# EAGLE design LNC (EAGLE 7.7.0)
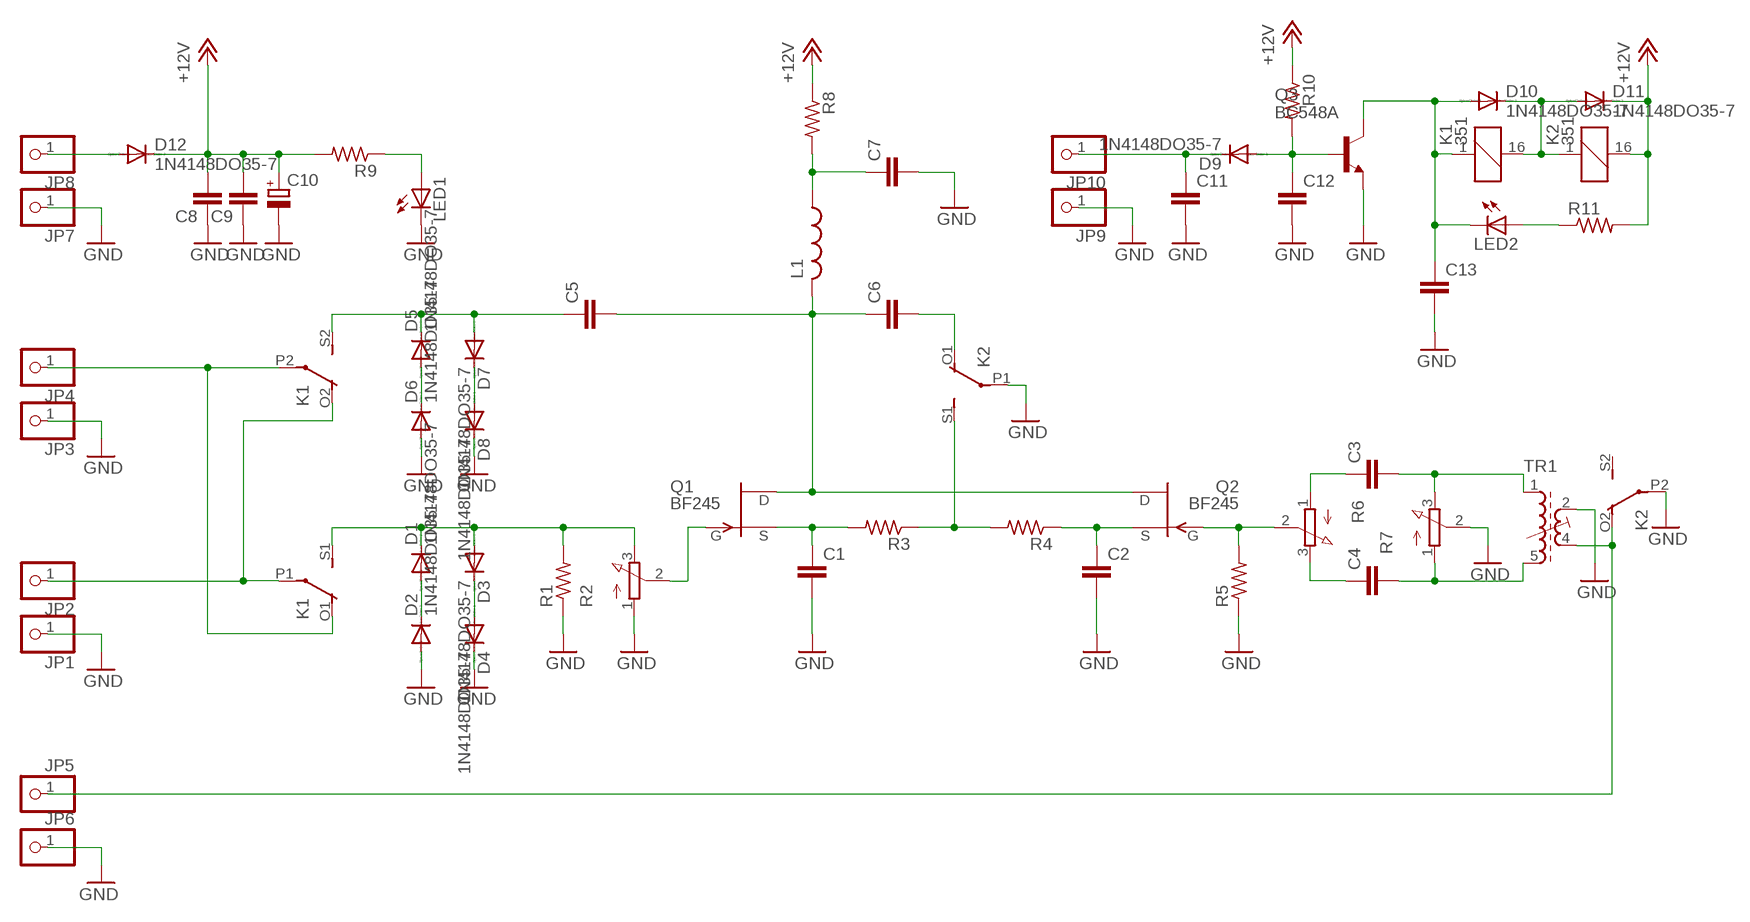
[diagram p0: schematic, sheet 1]

## Parts
C1  C-EU050-030X075  [C050-030X075]
C2  C-EU050-030X075  [C050-030X075]
C3  C-EU050-030X075  [C050-030X075]
C4  C-EU050-030X075  [C050-030X075]
C5  C-EU050-030X075  [C050-030X075]
C6  C-EU050-030X075  [C050-030X075]
C7  C-EU050-030X075  [C050-030X075]
C8  C-EU050-030X075  [C050-030X075]
C9  C-EU050-030X075  [C050-030X075]
C10  CPOL-EUE2.5-7  [E2,5-7]
C11  C-EU050-030X075  [C050-030X075]
C12  C-EU050-030X075  [C050-030X075]
C13  C-EU050-030X075  [C050-030X075]
D1  1N4148DO35-7  [DO35-7]
D2  1N4148DO35-7  [DO35-7]
D3  1N4148DO35-7  [DO35-7]
D4  1N4148DO35-7  [DO35-7]
D5  1N4148DO35-7  [DO35-7]
D6  1N4148DO35-7  [DO35-7]
D7  1N4148DO35-7  [DO35-7]
D8  1N4148DO35-7  [DO35-7]
D9  1N4148DO35-7  [DO35-7]
D10  1N4148DO35-7  [DO35-7]
D11  1N4148DO35-7  [DO35-7]
D12  1N4148DO35-7  [DO35-7]
JP1  PINHD-1X1  [1X01]
JP2  PINHD-1X1  [1X01]
JP3  PINHD-1X1  [1X01]
JP4  PINHD-1X1  [1X01]
JP5  PINHD-1X1  [1X01]
JP6  PINHD-1X1  [1X01]
JP7  PINHD-1X1  [1X01]
JP8  PINHD-1X1  [1X01]
JP9  PINHD-1X1  [1X01]
JP10  PINHD-1X1  [1X01]
K1  351  [351]
K2  351  [351]
L1  L-US0207/10  [0207/10]
LED1  LED3MM  [LED3MM]
LED2  LED3MM  [LED3MM]
Q1  BF245  [TO92]
Q2  BF245  [TO92]
Q3  BC548A  [TO92-EBC]
R1  R-US_0204/7  [0204/7]
R2  3RP/1610N  [3RP/1610N]
R3  R-US_0204/7  [0204/7]
R4  R-US_0204/7  [0204/7]
R5  R-US_0204/7  [0204/7]
R6  3RP/1610N  [3RP/1610N]
R7  3RP/1610N  [3RP/1610N]
R8  R-US_0204/7  [0204/7]
R9  R-US_0204/7  [0204/7]
R10  R-US_0204/7  [0204/7]
R11  R-US_0204/7  [0204/7]
TR1  71-4-1542  [71-5]

## Nets
+12V: C8.2 C9.2 C10.+ D11.C D12.C K2.16 R8.1 R9.2 R10.1 R11.2
GND: C1.2 C2.2 C7.2 C8.1 C9.1 C10.- C11.2 C12.2 C13.2 D2.A D4.C D6.A D8.C JP1.1 JP3.1 JP6.1 JP7.1 JP9.1 K2.P1(2:P) K2.P2(3:P) LED1.K(C) Q3.E R1.1 R2.1(A) R5.1 R7.2(S) TR1.2(A2)
N$1: JP4.1 K1.O1(2:O) K1.P2(3:P)
N$2: JP2.1 K1.O2(3:O) K1.P1(2:P)
N$3: Q1.3(G) R2.2(S)
N$4: C2.1 Q2.2(S) R4.1
N$5: C5.1 D5.C D7.A K1.S2(3:S)
N$6: D1.C D3.A K1.S1(2:S) R1.2 R2.3(E)
N$7: K2.S1(2:S) R3.1 R4.2
N$8: D1.A D2.C
N$9: D3.C D4.A
N$10: C1.1 Q1.2(S) R3.2
N$11: Q2.3(G) R5.2 R6.2(S)
N$12: C3.1 R6.1(A)
N$13: D5.A D6.C
N$14: D7.C D8.A
N$15: C3.2 R7.3(E) TR1.1(A1)
N$16: C4.2 R7.1(A) TR1.5(E1)
N$17: C4.1 R6.3(E)
N$18: C5.2 C6.1 L1.2 Q1.1(D) Q2.1(D)
N$19: C6.2 K2.O1(2:O)
N$20: JP5.1 K2.O2(3:O) TR1.4(E2)
N$21: D10.C D11.A K1.16 K2.1
N$22: C7.1 L1.1 R8.2
N$23: LED1.A R9.1
N$24: C12.1 D9.A Q3.B R10.2
N$25: C13.1 D10.A K1.1 LED2.K(C) Q3.C
N$26: LED2.A R11.1
N$27: C11.1 D9.C JP10.1
N$28: D12.A JP8.1
Unconnected: K2.S2(3:S) TR1.S1 TR1.S2

## Library data of the parts
C1-C9 C11-C13 = rcl:C-EU: CAPACITOR, European symbol
C10 = rcl:CPOL-EU: POLARIZED CAPACITOR, European symbol
D1-D12 = diode:1N4148: DIODE high speed (Philips)
JP1-JP10 = pinhead:PINHD-1X1: PIN HEADER
K1 K2 = relay:351: RELAY 2 x switch, Omron; OC_FARNELL: unknown; OC_NEWARK: unknown
L1 = rcl:L-US: INDUCTOR, American symbol
LED1 LED2 = led:LED: LED OSRAM: - CHIPLED LG R971, LG N971, LY N971, LG Q971, LY Q971, LO R971, LY R971 LH N974, LH R974 LS Q976, LO Q976, LY Q976 LO Q996 - Hyper CHIPLED LW Q18S LB Q993, LB Q99A, LB R99A - SideLED LS A670, LO A670, LY A670, LG A670, LP A670 LB A673, LV A673, LT A673, LW A673 LH A674 LY A675 LS A676, LA A676, LO A676, LY A676, LW A676 LS A679, LY A679, LG A679 - Hyper Micro SIDELED® LS Y876, LA Y876, LO Y876, LY Y876 LT Y87S - SmartLED LW L88C, LW L88S LB L89C, LB L89S, LG L890 LS L89K, LO L89K, LY L89K LS L896, LA L896, LO L896, LY L896 - TOPLED LS T670, LO T670, LY T670, LG T670, LP T670 LSG T670, LSP T670, LSY T670, LOP T670, LYG T670 LG T671, LOG T671, LSG T671 LB T673, LV T673, LT T673, LW T673 LH T674 LS T676, LA T676, LO T676, LY T676, LB T676, LH T676, LSB T676, LW T676 LB T67C, LV T67C, LT T67C, LS T67K, LO T67K, LY T67K, LW E67C LS E67B, LA E67B, LO E67B, LY E67B, LB E67C, LV E67C, LT E67C LW T67C LS T679, LY T679, LG T679 LS T770, LO T770, LY T770, LG T770, LP T770 LB T773, LV T773, LT T773, LW T773 LH T774 LS E675, LA E675, LY E675, LS T675 LS T776, LA T776, LO T776, LY T776, LB T776 LHGB T686 LT T68C, LB T68C - Hyper Mini TOPLED® LB M676 - Mini TOPLED Santana® LG M470 LS M47K, LO M47K, LY M47K Source: http://www.osram.convergy.de LUXEON: - LUMILED® LXK2-PW12-R00, LXK2-PW12-S00, LXK2-PW14-U00, LXK2-PW14-V00 LXK2-PM12-R00, LXK2-PM12-S00, LXK2-PM14-U00 LXK2-PE12-Q00, LXK2-PE12-R00, LXK2-PE12-S00, LXK2-PE14-T00, LXK2-PE14-U00 LXK2-PB12-K00, LXK2-PB12-L00, LXK2-PB12-M00, LXK2-PB14-N00, LXK2-PB14-P00, LXK2-PB14-Q00 LXK2-PR12-L00, LXK2-PR12-M00, LXK2-PR14-Q00, LXK2-PR14-R00 LXK2-PD12-Q00, LXK2-PD12-R00, LXK2-PD12-S00 LXK2-PH12-R00, LXK2-PH12-S00 LXK2-PL12-P00, LXK2-PL12-Q00, LXK2-PL12-R00 Source: www.luxeon.com KINGBRIGHT: KA-3528ASYC Source: www.kingbright.com
Q1 Q2 = transistor-fet:BF245: N-Channel Junction FET http://www.onsemi.com/pub/Collateral/BF245A-D.PDF
Q3 = transistor-npn:BC548*: NPN Transistor
R1 R3-R5 R8-R11 = rcl:R-US_: RESISTOR, American symbol
R2 R6 R7 = pot:3RP/1610N: 16mm Potentiometer one level Source: http://www.alphapotentiometers.net/html/16mm_pot_2.html
TR1 = inductor-neosid:71-4-: TRANSFORMER adjustable filter transformer; OC_FARNELL: unknown; OC_NEWARK: unknown

## Board
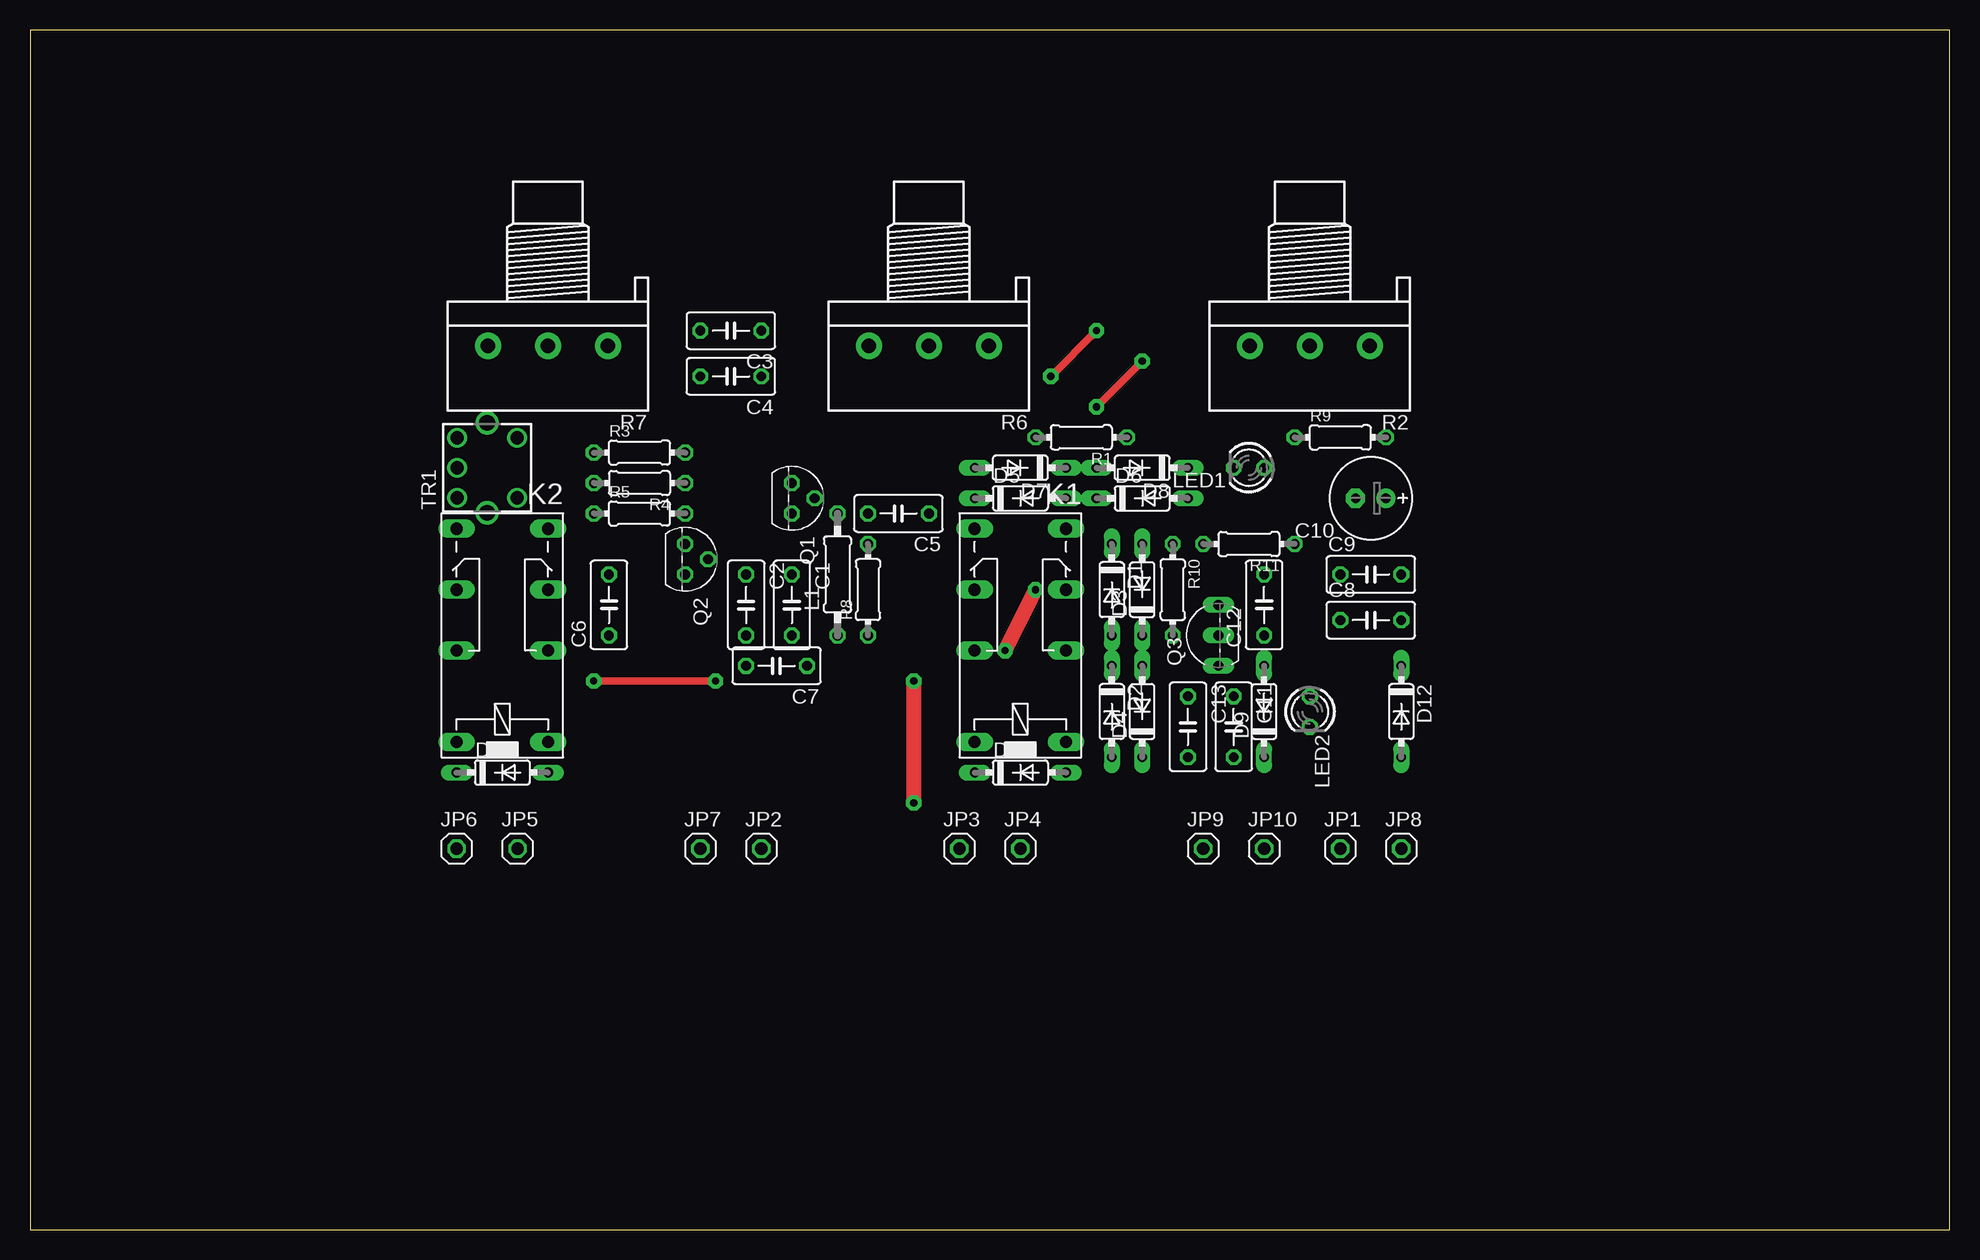
[diagram p1: board, top side]
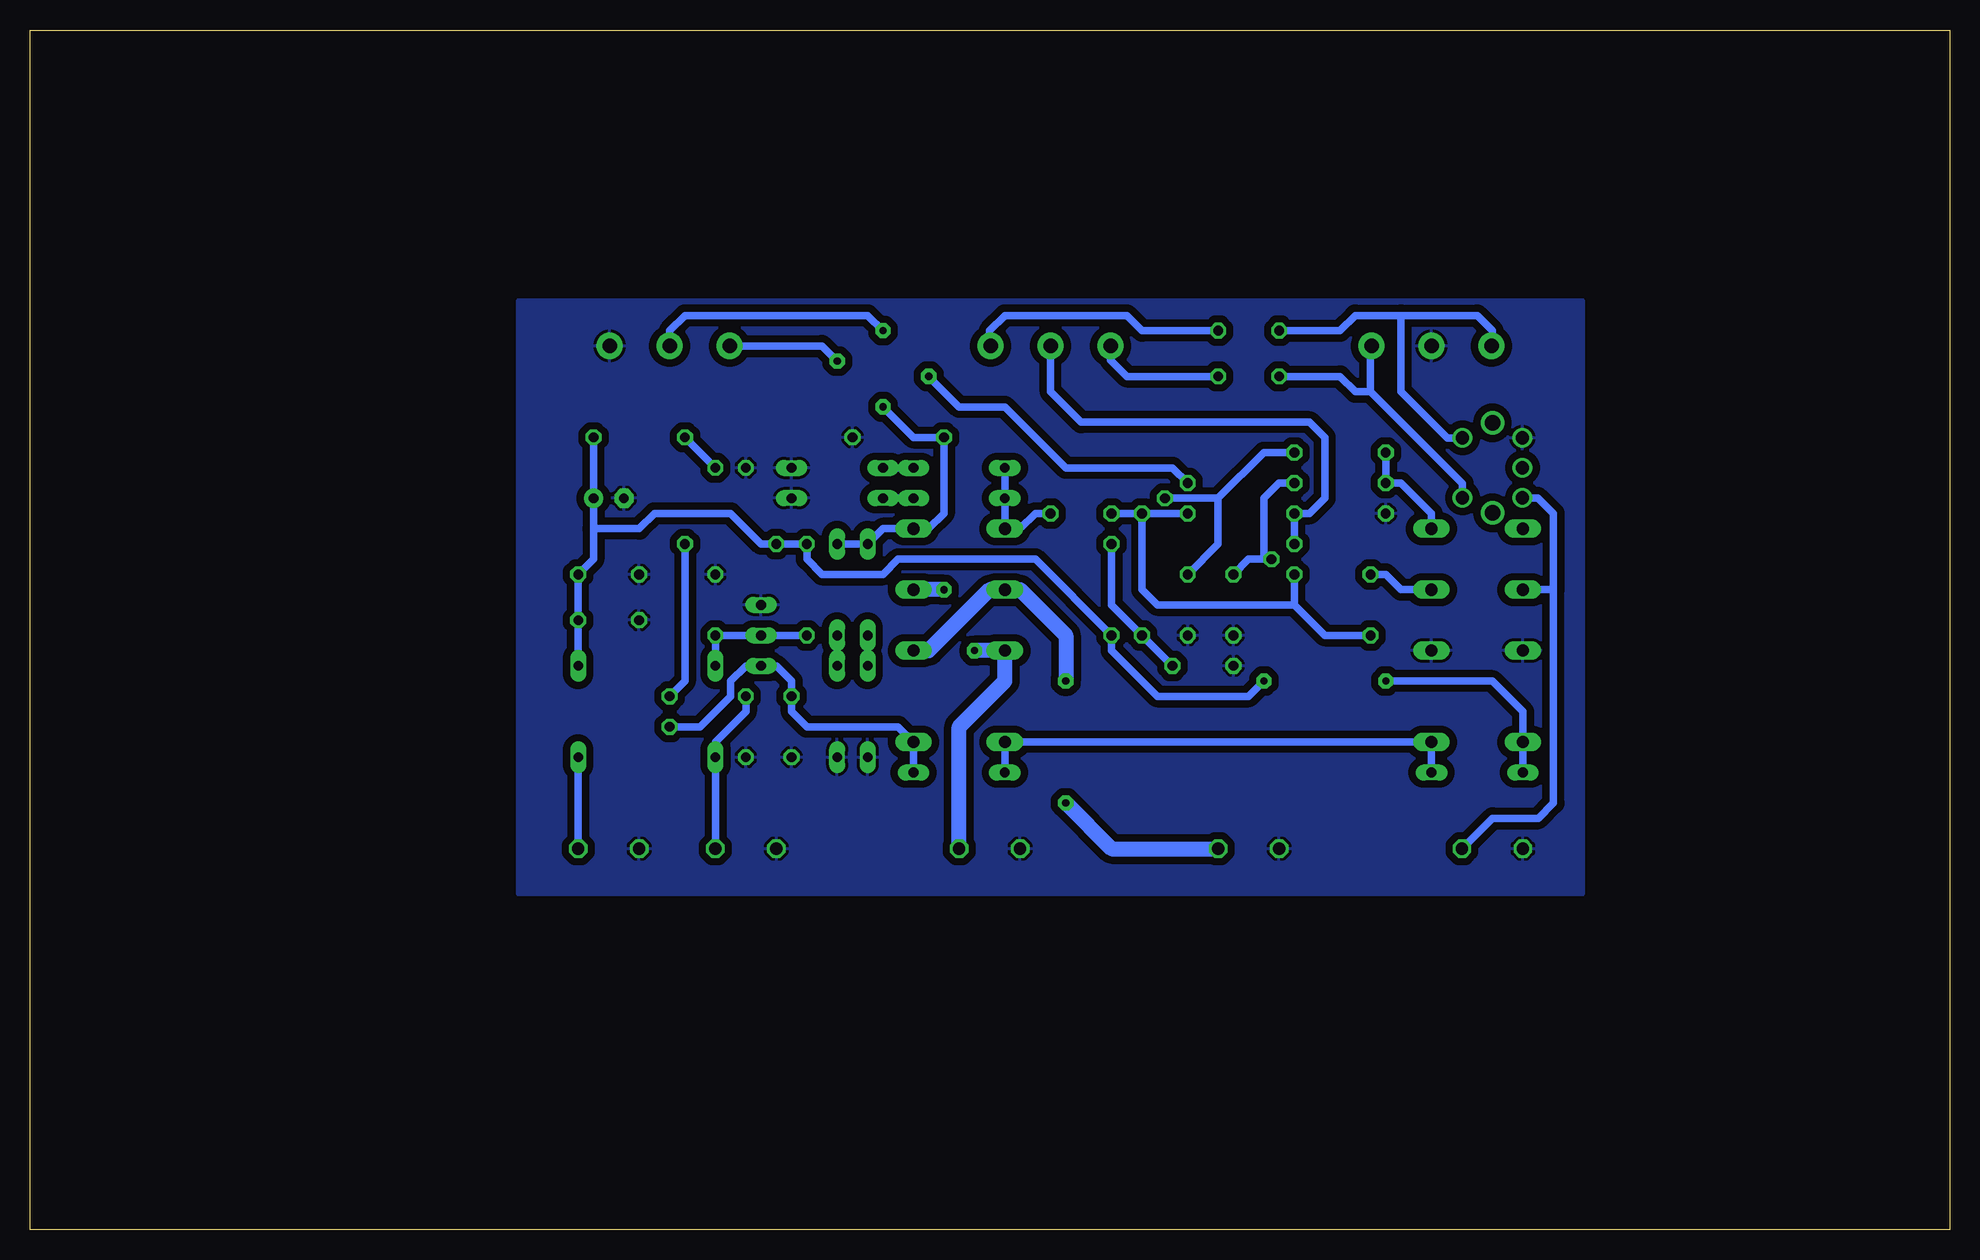
[diagram p2: board, bottom side, seen from below]

Size 160 x 100 mm. Coordinates in mm from the lower left corner, seen from the top.
Outline: 0,0 160,0 160,100 0,100 0,0
Copper layers (1*16): Top 0.035mm / dielectric 1.5mm / Bottom 0.035mm
Design rules "default": minimum track width 10mil, minimum drill 24mil, track to track 8mil, track to pad 8mil, pad to pad 8mil, via to via 8mil, smd to smd 8mil, copper to edge 40mil, drill to drill 8mil, minimum pad ring 10mil, minimum via ring 8mil, stop-mask expansion 4mil, vias tented up to drill 0mil, thermal gap 10mil

### Footprints (pad centres in the part's own frame; a part is rotated, then mirrored left to right if it is on the bottom)
C050-030X075 = drill 0.813 octagon: 1 -2.54,0; 2 2.54,0
E2,5-7 = drill 0.813 pad 1.6: + -1.27,0 | drill 0.813 pad 1.6 octagon: - 1.27,0
DO35-7 = drill 0.813 long: A 3.81,0; C -3.81,0
1X01 = drill 1.016 octagon: 1 0,0
351 = drill 1.016 long: 1 -3.81,-3.81; 16 -3.81,3.81; O1 8.89,-3.81; O2 8.89,3.81; P1 3.81,-3.81; P2 3.81,3.81; S1 13.97,-3.81; S2 13.97,3.81
0207/10 = drill 0.813 octagon: 1 -5.08,0; 2 5.08,0
LED3MM = drill 0.813 octagon: A -1.27,0; K 1.27,0
TO92 = drill 0.813 octagon: 1 1.27,0; 2 0,1.905; 3 -1.27,0
TO92-EBC = drill 0.813 long: B 0,-1.27; C -2.54,-1.27; E 2.54,-1.27
0204/7 = drill 0.813 octagon: 1 -3.81,0; 2 3.81,0
3RP/1610N = drill 1.2 pad 2.184: 1 -5,0; 2 0,0; 3 5,0
71-5 = drill 1.1: 1 2.5,-2.5; 2 2.5,2.5; 3 0,2.5; 4 -2.5,2.5; 5 -2.5,-2.5 | drill 1.3: S1 -3.75,0; S2 3.75,0

### Placement (x,y rotation side)
C1  63.5,52.07 270 top
C2  59.69,52.07 270 top
C3  58.42,74.93 180 top
C4  58.42,71.12 180 top
C5  72.39,59.69 180 top
C6  48.26,52.07 90 top
C7  62.23,46.99 180 top
C8  111.76,50.8 0 top
C9  111.76,54.61 0 top
C10  111.76,60.96 180 top
C11  100.33,41.91 270 top
C12  102.87,52.07 90 top
C13  96.52,41.91 270 top
D1  90.17,53.34 270 top
D2  90.17,43.18 270 top
D3  92.71,53.34 90 top
D4  92.71,43.18 90 top
D5  82.55,60.96 0 top
D6  92.71,60.96 0 top
D7  82.55,63.5 180 top
D8  92.71,63.5 180 top
D9  102.87,43.18 90 top
D10  82.55,38.1 0 top
D11  39.37,38.1 0 top
D12  114.3,43.18 270 top
JP1  109.22,31.75 0 top
JP2  60.96,31.75 0 top
JP3  77.47,31.75 0 top
JP4  82.55,31.75 0 top
JP5  40.64,31.75 0 top
JP6  35.56,31.75 0 top
JP7  55.88,31.75 0 top
JP8  114.3,31.75 0 top
JP9  97.79,31.75 0 top
JP10  102.87,31.75 0 top
K1  82.55,44.45 90 top
K2  39.37,44.45 90 top
L1  67.31,54.61 90 top
LED1  101.6,63.5 180 top
LED2  106.68,43.18 270 top
Q1  63.5,60.96 270 top
Q2  54.61,55.88 270 top
Q3  97.79,49.53 90 top
R1  87.63,66.04 180 top
R2  106.68,73.66 180 top
R3  50.8,64.77 0 top
R4  50.8,62.23 180 top
R5  50.8,59.69 0 top
R6  74.93,73.66 180 top
R7  43.18,73.66 180 top
R8  69.85,53.34 90 top
R9  109.22,66.04 0 top
R10  95.25,53.34 270 top
R11  101.6,57.15 180 top
TR1  38.1,63.5 90 top

### Tracks (layer width: path | path; a pad name or v marks a point on that pad's centre or on a via)
+12V  (via drill 0.6 pad 1.27)
  Top 0.61: v46.99,45.72 v57.15,45.72
  Bottom 0.61: v57.15,45.72 58.42,44.45 66.04,44.45 69.85,48.26 R8.1 76.2,55.88 87.63,55.88 88.9,54.61 93.98,54.61 95.25,55.88 R10.1 R11.2 99.06,57.15 101.6,59.69 107.95,59.69 109.22,58.42 113.03,58.42 | D11.C K2.16 35.56,43.18 38.1,45.72 v46.99,45.72 | D12.C C8.2 C9.2 113.03,55.88 113.03,58.42 | 113.03,58.42 C10.+ R9.2
GND
  pour Bottom (isolate 0.61): 30.48,77.47 119.38,77.47 119.38,27.94 30.48,27.94
N$1  (via drill 0.6 pad 1.27)
  Top 1.27: v81.28,48.26 v83.82,53.34
  Bottom 1.27: JP4.1 82.55,41.91 78.74,45.72 K1.P2 v81.28,48.26 | v83.82,53.34 K1.O1
N$2  (via drill 0.6 pad 1.27)
  Top 1.27: v73.66,45.72 v73.66,35.56
  Bottom 1.27: K1.P1 85.09,48.26 80.01,53.34 K1.O2 77.47,53.34 73.66,49.53 v73.66,45.72 | v73.66,35.56 69.85,31.75 JP2.1
N$3  (via drill 0.6 pad 1.27)
  Top 0.61: v85.09,71.12 v88.9,74.93
  Bottom 0.61: Q1.3 64.77,63.5 73.66,63.5 78.74,68.58 82.55,68.58 v85.09,71.12 | R2.2 106.68,74.93 105.41,76.2 90.17,76.2 v88.9,74.93
N$4
  Bottom 0.61: C2.1 58.42,55.88 57.15,55.88 | 57.15,55.88 Q2.2 | R4.1 55.88,62.23 57.15,60.96 57.15,55.88
N$5
  Bottom 0.61: C5.1 76.2,59.69 77.47,58.42 K1.S2 D5.C D7.A
N$6  (via drill 0.6 pad 1.27)
  Top 0.61: v88.9,68.58 v92.71,72.39
  Bottom 0.61: D3.A D1.C 88.9,58.42 K1.S1 85.09,58.42 83.82,59.69 R1.2 86.36,66.04 v88.9,68.58 | R2.3 93.98,73.66 v92.71,72.39
N$7
  Bottom 0.61: R3.1 R4.2 45.72,62.23 43.18,59.69 K2.S1
N$8
  Bottom 0.61: D1.A D2.C
N$9
  Bottom 0.61: D4.A D3.C
N$10
  Bottom 0.61: Q1.2 60.96,60.96 | 60.96,60.96 57.15,64.77 R3.2 | 60.96,60.96 60.96,57.15 C1.1
N$11
  Bottom 0.61: Q2.3 R5.2 53.34,59.69 52.07,60.96 52.07,66.04 53.34,67.31 72.39,67.31 74.93,69.85 R6.2
N$12
  Bottom 0.61: C3.1 67.31,74.93 68.58,76.2 78.74,76.2 80.01,74.93 R6.1
N$13
  Bottom 0.61: D6.C D5.A
N$14
  Bottom 0.61: D7.C D8.A
N$15
  Bottom 0.61: C3.2 50.8,74.93 49.53,76.2 45.72,76.2 | 45.72,76.2 39.37,76.2 38.1,74.93 R7.3 | TR1.1 41.87,66 45.72,69.85 45.72,76.2
N$16
  Bottom 0.61: TR1.5 40.6,62.19 48.26,69.85 | 48.26,69.85 48.26,73.66 R7.1 | C4.2 50.8,71.12 49.53,69.85 48.26,69.85
N$17
  Bottom 0.61: R6.3 69.93,72.47 68.58,71.12 C4.1
N$18
  Bottom 0.61: L1.2 67.31,53.34 66.04,52.07 54.61,52.07 | 54.61,52.07 52.07,49.53 C6.1 | 54.61,52.07 Q2.1 | Q1.1 L1.2 | L1.2 C5.2
N$19
  Bottom 0.61: C6.2 46.99,54.61 45.72,53.34 K2.O1
N$20
  Bottom 0.61: TR1.4 34.33,61 33.02,59.69 33.02,53.34 | 33.02,53.34 K2.O2 | JP5.1 38.1,34.29 34.29,34.29 33.02,35.56 33.02,53.34
N$21
  Bottom 0.61: D10.C K1.16 K2.1 D11.A
N$22
  Bottom 0.61: C7.1 L1.1 69.85,52.07 R8.2
N$23
  Bottom 0.61: R9.1 LED1.A
N$24
  Bottom 0.61: R10.2 Q3.B C12.1 D9.A
N$25
  Bottom 0.61: D10.A K1.1 87.63,41.91 95.25,41.91 96.52,43.18 C13.1 96.52,45.72 97.79,46.99 Q3.C 100.33,46.99 101.6,45.72 101.6,44.45 104.14,41.91 LED2.K
N$26
  Bottom 0.61: R11.1 105.41,45.72 LED2.A
N$27
  Bottom 0.61: C11.1 100.33,43.18 102.87,40.64 D9.C JP10.1
N$28
  Bottom 0.61: D12.A JP8.1